# EAGLE design recepteur_ir (EAGLE 6.5.0)
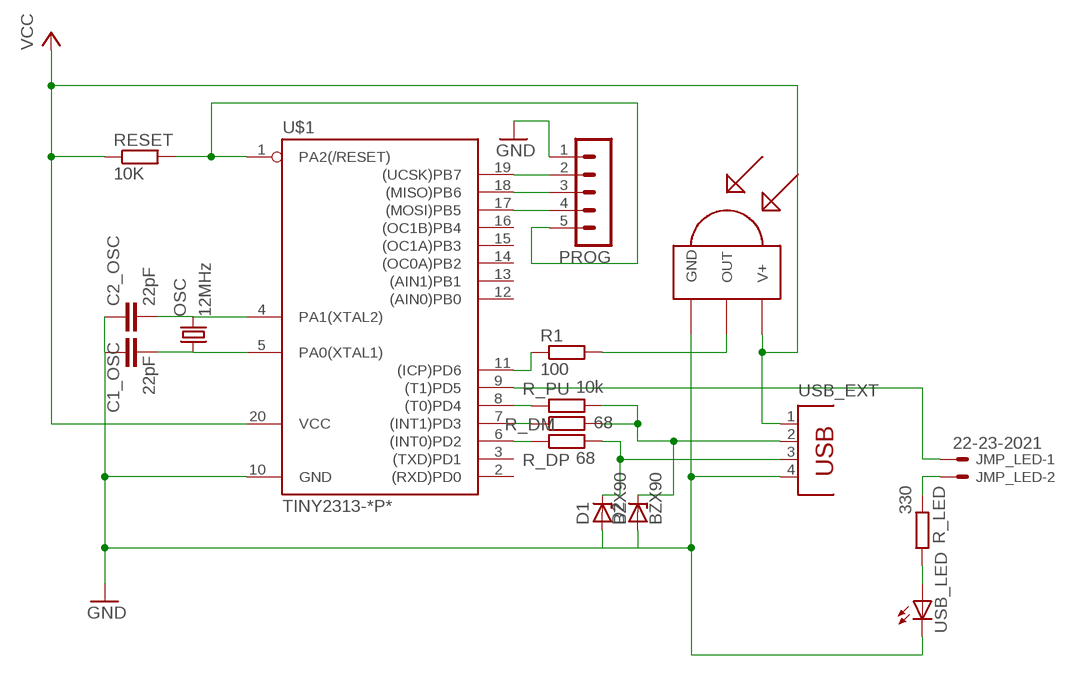
[diagram p0: schematic, sheet 1]

## Parts
C1_OSC  22pF  C-EU025-040X050  [C025-040X050]
C2_OSC  22pF  C-EU025-040X050  [C025-040X050]
D1  BZX90  [DO34Z7]
D2  BZX90  [DO34Z7]
JMP_LED  22-23-2021  [22-23-2021]
OSC  12MHz  CRYSTALHC49S  [HC49/S]
PROG  MA05-1  [MA05-1]
R1  100  R-EU_0204/7  [0204/7]
R_DM  68  R-EU_0204/7  [0204/7]
R_DP  68  R-EU_0204/7  [0204/7]
R_LED  330  R-EU_0204/7  [0204/7]
R_PU  10k  R-EU_0204/7  [0204/7]
RESET  10K  R-EU_0204/7  [0204/7]
U$1  TINY2313-*P*  [DIL20]
U$2  TSOP2238  [TSOP2XXX]
USB_EXT  PN61729  [PN61729]
USB_LED  LED3MM  [LED3MM]

## Nets
GND: C1_OSC.1 C2_OSC.1 D1.A D2.A PROG.1 U$1.10(GND) U$2.GND USB_EXT.4 USB_LED.K(C)
N$1: C2_OSC.2 OSC.2 U$1.4(PA1(XTAL2))
N$2: C1_OSC.2 OSC.1 U$1.5(PA0(XTAL1))
N$3: R1.2 U$2.OUT
N$4: PROG.5 RESET.2 U$1.1(PA2(/RESET))
N$5: D2.C R_DM.2 R_PU.2 USB_EXT.2
N$6: R_PU.1 U$1.8((T0)PD4)
N$7: R_DM.1 U$1.7((INT1)PD3)
N$8: R_DP.1 U$1.6((INT0)PD2)
N$9: D1.C R_DP.2 USB_EXT.3
N$10: JMP_LED.1 U$1.9((T1)PD5)
N$11: R_LED.2 USB_LED.A
N$12: JMP_LED.2 R_LED.1
N$13: PROG.2 U$1.19((UCSK)PB7)
N$14: PROG.3 U$1.18((MISO)PB6)
N$15: PROG.4 U$1.17((MOSI)PB5)
N$18: R1.1 U$1.11((ICP)PD6)
VCC: RESET.1 U$1.20(VCC) U$2.VCC(V+) USB_EXT.1
Unconnected: U$1.2((RXD)PD0) U$1.3((TXD)PD1) U$1.12((AIN0)PB0) U$1.13((AIN1)PB1) U$1.14((OC0A)PB2) U$1.15((OC1A)PB3) U$1.16((OC1B)PB4)

## Library data of the parts
C1_OSC C2_OSC = resistor:C-EU: CAPACITOR, European symbol
D1 D2 = diode:BZX90: Z DIODE
JMP_LED = con-molex:22-23-2021: .100" (2.54mm) Center Header - 2 Pin; MF: MOLEX; MPN: 22-23-2021; OC_FARNELL: 1462926; OC_NEWARK: 25C3832
OSC = crystal:CRYSTAL: CRYSTAL; OC_FARNELL: 1667008; OC_NEWARK: unknown
PROG = con-lstb:MA05-1: PIN HEADER; OC_FARNELL: unknown; OC_NEWARK: unknown
R1 R_DM R_DP R_LED R_PU RESET = resistor:R-EU_: RESISTOR, European symbol
U$1 = avr-6:TINY2313*: Atmel Tiny2313 2K Flash, 128 bytes EEPROM, 128 bytes RAM
U$2 = tsop:TSOP2238: TSOP2238
USB_EXT = ardutemp:PN61729: BERG USB connector; OC_FARNELL: unknown; OC_NEWARK: unknown
USB_LED = led:LED: LED OSRAM: - CHIPLED LG R971, LG N971, LY N971, LG Q971, LY Q971, LO R971, LY R971 LH N974, LH R974 LS Q976, LO Q976, LY Q976 LO Q996 - Hyper CHIPLED LW Q18S LB Q993, LB Q99A, LB R99A - SideLED LS A670, LO A670, LY A670, LG A670, LP A670 LB A673, LV A673, LT A673, LW A673 LH A674 LY A675 LS A676, LA A676, LO A676, LY A676, LW A676 LS A679, LY A679, LG A679 - Hyper Micro SIDELED® LS Y876, LA Y876, LO Y876, LY Y876 LT Y87S - SmartLED LW L88C, LW L88S LB L89C, LB L89S, LG L890 LS L89K, LO L89K, LY L89K LS L896, LA L896, LO L896, LY L896 - TOPLED LS T670, LO T670, LY T670, LG T670, LP T670 LSG T670, LSP T670, LSY T670, LOP T670, LYG T670 LG T671, LOG T671, LSG T671 LB T673, LV T673, LT T673, LW T673 LH T674 LS T676, LA T676, LO T676, LY T676, LB T676, LH T676, LSB T676, LW T676 LB T67C, LV T67C, LT T67C, LS T67K, LO T67K, LY T67K, LW E67C LS E67B, LA E67B, LO E67B, LY E67B, LB E67C, LV E67C, LT E67C LW T67C LS T679, LY T679, LG T679 LS T770, LO T770, LY T770, LG T770, LP T770 LB T773, LV T773, LT T773, LW T773 LH T774 LS E675, LA E675, LY E675, LS T675 LS T776, LA T776, LO T776, LY T776, LB T776 LHGB T686 LT T68C, LB T68C - Hyper Mini TOPLED® LB M676 - Mini TOPLED Santana® LG M470 LS M47K, LO M47K, LY M47K Source: http://www.osram.convergy.de LUXEON: - LUMILED® LXK2-PW12-R00, LXK2-PW12-S00, LXK2-PW14-U00, LXK2-PW14-V00 LXK2-PM12-R00, LXK2-PM12-S00, LXK2-PM14-U00 LXK2-PE12-Q00, LXK2-PE12-R00, LXK2-PE12-S00, LXK2-PE14-T00, LXK2-PE14-U00 LXK2-PB12-K00, LXK2-PB12-L00, LXK2-PB12-M00, LXK2-PB14-N00, LXK2-PB14-P00, LXK2-PB14-Q00 LXK2-PR12-L00, LXK2-PR12-M00, LXK2-PR14-Q00, LXK2-PR14-R00 LXK2-PD12-Q00, LXK2-PD12-R00, LXK2-PD12-S00 LXK2-PH12-R00, LXK2-PH12-S00 LXK2-PL12-P00, LXK2-PL12-Q00, LXK2-PL12-R00 Source: www.luxeon.com KINGBRIGHT: KA-3528ASYC Source: www.kingbright.com

## Board
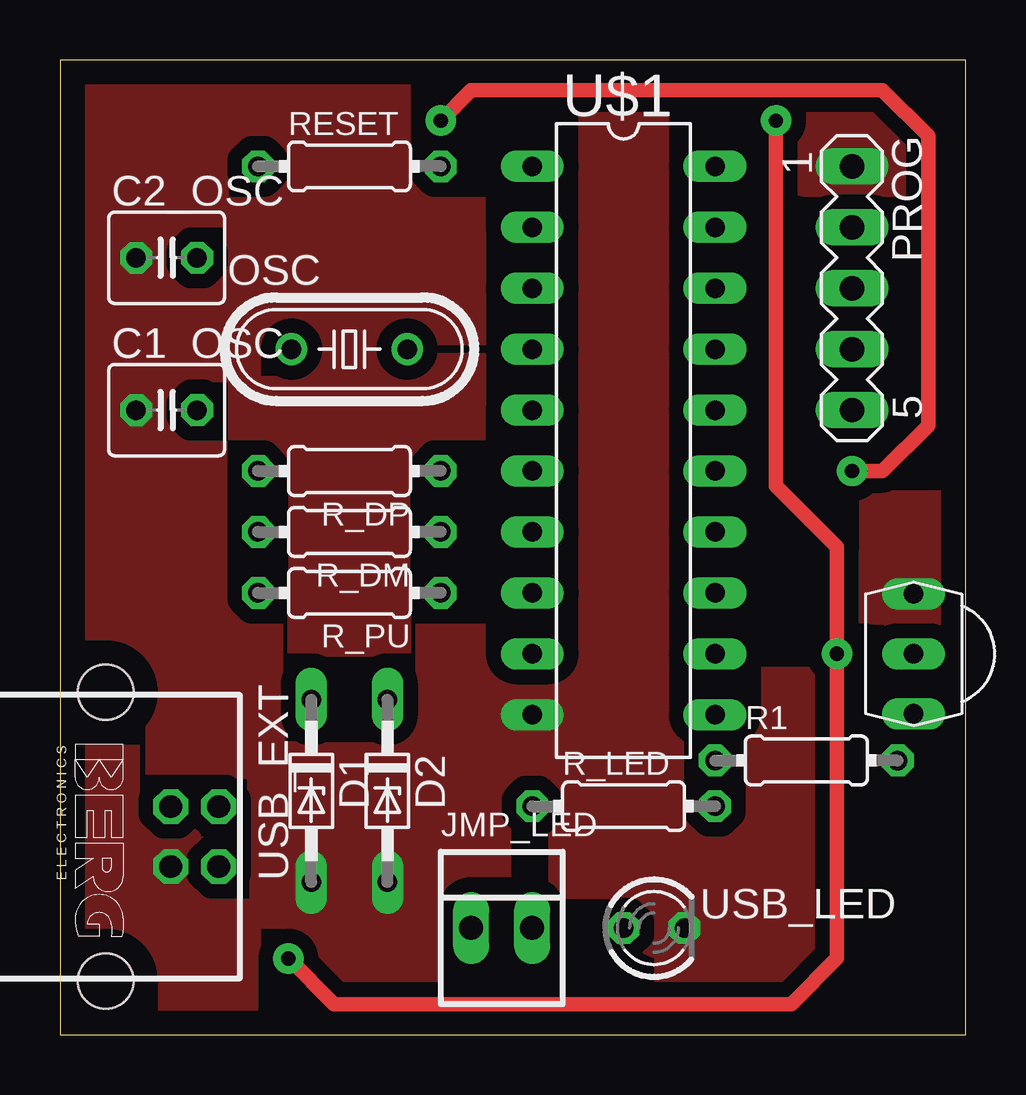
[diagram p1: board, top side]
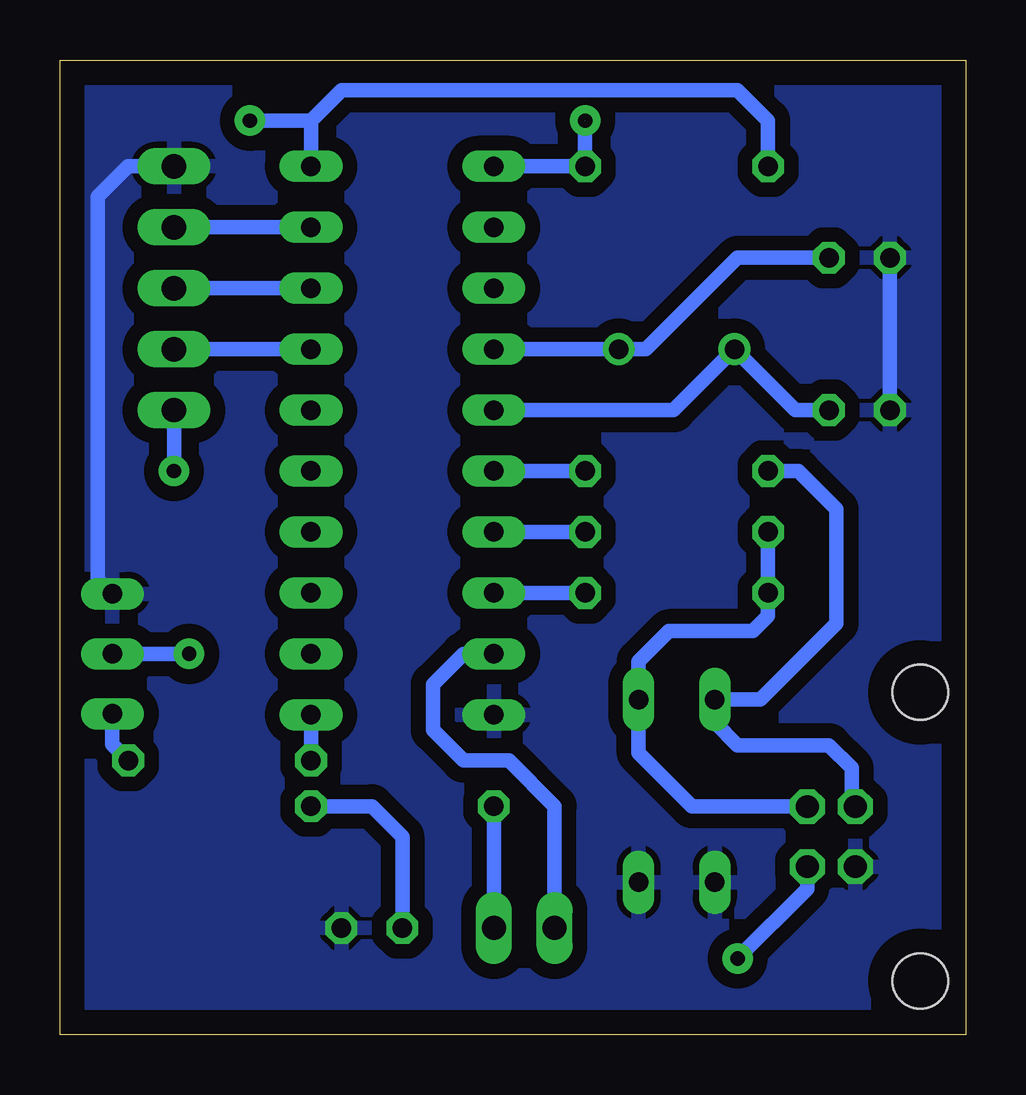
[diagram p2: board, bottom side, seen from below]

Size 37.77 x 40.63 mm. Coordinates in mm from the lower left corner, seen from the top.
Outline: 0,0 37.77,0 37.77,40.63 0,40.63 0,0
Copper layers (1*16): Top 0.035mm / dielectric 1.5mm / Bottom 0.035mm
Design rules "default": minimum track width 10mil, minimum drill 24mil, track to track 8mil, track to pad 8mil, pad to pad 8mil, via to via 8mil, smd to smd 8mil, copper to edge 40mil, drill to drill 8mil, minimum pad ring 10mil, minimum via ring 8mil, stop-mask expansion 4mil, vias tented up to drill 0mil, thermal gap 10mil

### Footprints (pad centres in the part's own frame; a part is rotated, then mirrored left to right if it is on the bottom)
C025-040X050 = drill 0.813 octagon: 1 -1.27,0; 2 1.27,0
DO34Z7 = drill 0.813 long: A 3.81,0; C -3.81,0
22-23-2021 = drill 1 long: 1 -1.27,0; 2 1.27,0
HC49/S = drill 0.813: 1 -2.413,0; 2 2.413,0
MA05-1 = drill 1.016 long: 1 -5.08,0; 2 -2.54,0; 3 0,0; 4 2.54,0; 5 5.08,0
0204/7 = drill 0.813 octagon: 1 -3.81,0; 2 3.81,0
DIL20 = drill 0.813 long: 1 -11.43,-3.81; 2 -8.89,-3.81; 3 -6.35,-3.81; 4 -3.81,-3.81; 5 -1.27,-3.81; 6 1.27,-3.81; 7 3.81,-3.81; 8 6.35,-3.81; 9 8.89,-3.81; 10 11.43,-3.81; 11 11.43,3.81; 12 8.89,3.81; 13 6.35,3.81; 14 3.81,3.81; 15 1.27,3.81; 16 -1.27,3.81; 17 -3.81,3.81; 18 -6.35,3.81; 19 -8.89,3.81; 20 -11.43,3.81
TSOP2XXX = drill 0.813 long: GND 2.499,-0.027; OUT -2.501,-0.027; VCC -0.001,-0.027
PN61729 = drill 0.95 octagon: 1 1.25,4.71; 2 -1.25,4.71; 3 -1.25,2.71; 4 1.25,2.71 | hole 2.3: -6.02,0; 6.02,0
LED3MM = drill 0.813 octagon: A -1.27,0; K 1.27,0

### Placement (x,y rotation side)
C1_OSC  4.44,26.04 0 top
C2_OSC  4.44,32.39 0 top
D1  10.48,10.16 270 top
D2  13.65,10.16 270 top
JMP_LED  18.41,4.45 0 top
OSC  12.07,28.58 0 top
PROG  33.02,31.12 270 top
R1  31.12,11.43 0 top
R_DM  12.07,20.95 180 top
R_DP  12.07,23.5 180 top
R_LED  23.49,9.53 0 top
R_PU  12.07,18.41 180 top
RESET  12.07,36.2 0 top
U$1  23.49,24.77 270 top
U$2  35.56,15.88 90 top
USB_EXT  1.91,8.26 270 top
USB_LED  24.77,4.45 0 top

### Tracks (layer width: path | path; a pad name or v marks a point on that pad's centre or on a via)
GND
  Bottom 0.61: PROG.1 34.92,36.2 36.2,34.93 36.2,18.98 U$2.GND | C2_OSC.1 C1_OSC.1
  pour Bottom (isolate 0.61): -5.71,43.81 -5.71,-2.54 41.27,-2.54 41.27,-1.9 41.27,43.81
  pour Top (isolate 0.61): -14.6,42.55 48.89,42.55 48.89,-8.25 -14.6,-8.25
N$1
  Bottom 0.61: U$1.4 OSC.2 13.34,28.58 9.53,32.39 C2_OSC.2
N$2
  Bottom 0.61: C1_OSC.2 7.11,26.04 OSC.1 12.19,26.04 U$1.5
N$3
  Bottom 0.61: R1.2 35.59,12.09 U$2.OUT
N$4  (via drill 0.6 pad 1.27)  (1 unrouted)
  Top 0.61: v33.02,23.5 34.29,23.5 36.2,25.4 36.2,37.47 34.29,39.37 17.14,39.37 15.88,38.1
  Bottom 0.61: 15.88,38.1 RESET.2 U$1.1 | PROG.5 v33.02,23.5
N$5
  Bottom 0.61: R_DM.2 R_PU.2 8.26,17.46 8.89,16.83 12.38,16.83 13.65,15.56 D2.C 13.65,11.75 11.43,9.53 6.63,9.53 USB_EXT.2
N$6
  Bottom 0.61: R_PU.1 U$1.8
N$7
  Bottom 0.61: R_DM.1 U$1.7
N$8
  Bottom 0.61: R_DP.1 U$1.6
N$9
  Bottom 0.61: USB_EXT.3 4.76,9.65 4.76,11.11 5.71,12.07 9.53,12.07 10.48,13.02 D1.C 8.57,13.97 5.4,17.15 5.4,21.91 6.99,23.5 R_DP.2
N$10
  Bottom 0.61: JMP_LED.1 17.14,9.53 19.05,11.43 20.95,11.43 22.22,12.7 22.22,14.61 20.95,15.88 U$1.9
N$11
  Bottom 0.61: R_LED.2 24.77,9.53 23.49,8.26 USB_LED.A
N$12
  Bottom 0.61: JMP_LED.2 R_LED.1
N$13
  Bottom 0.61: U$1.19 PROG.2
N$14
  Bottom 0.61: U$1.18 PROG.3
N$15
  Bottom 0.61: U$1.17 PROG.4
N$16  (via drill 0.6 pad 1.27)
  other vias: 15.88,38.1
N$18
  Bottom 0.61: U$1.11 R1.1
VCC  (via drill 0.6 pad 1.27)
  Top 0.61: v9.53,3.18 11.43,1.27 30.48,1.27 32.38,3.18 v32.38,15.88 v32.39,15.87 32.39,20.32 29.84,22.86 v29.84,38.1
  Bottom 0.61: U$1.20 27.3,38.1 | 27.3,38.1 26.04,39.37 9.53,39.37 8.26,38.1 RESET.1 | U$2.VCC v32.39,15.87 | v29.84,38.1 27.3,38.1 | v9.53,3.18 6.61,6.09 USB_EXT.1